# EAGLE design I2C-LEDStripDriver (EAGLE 7.7.0)
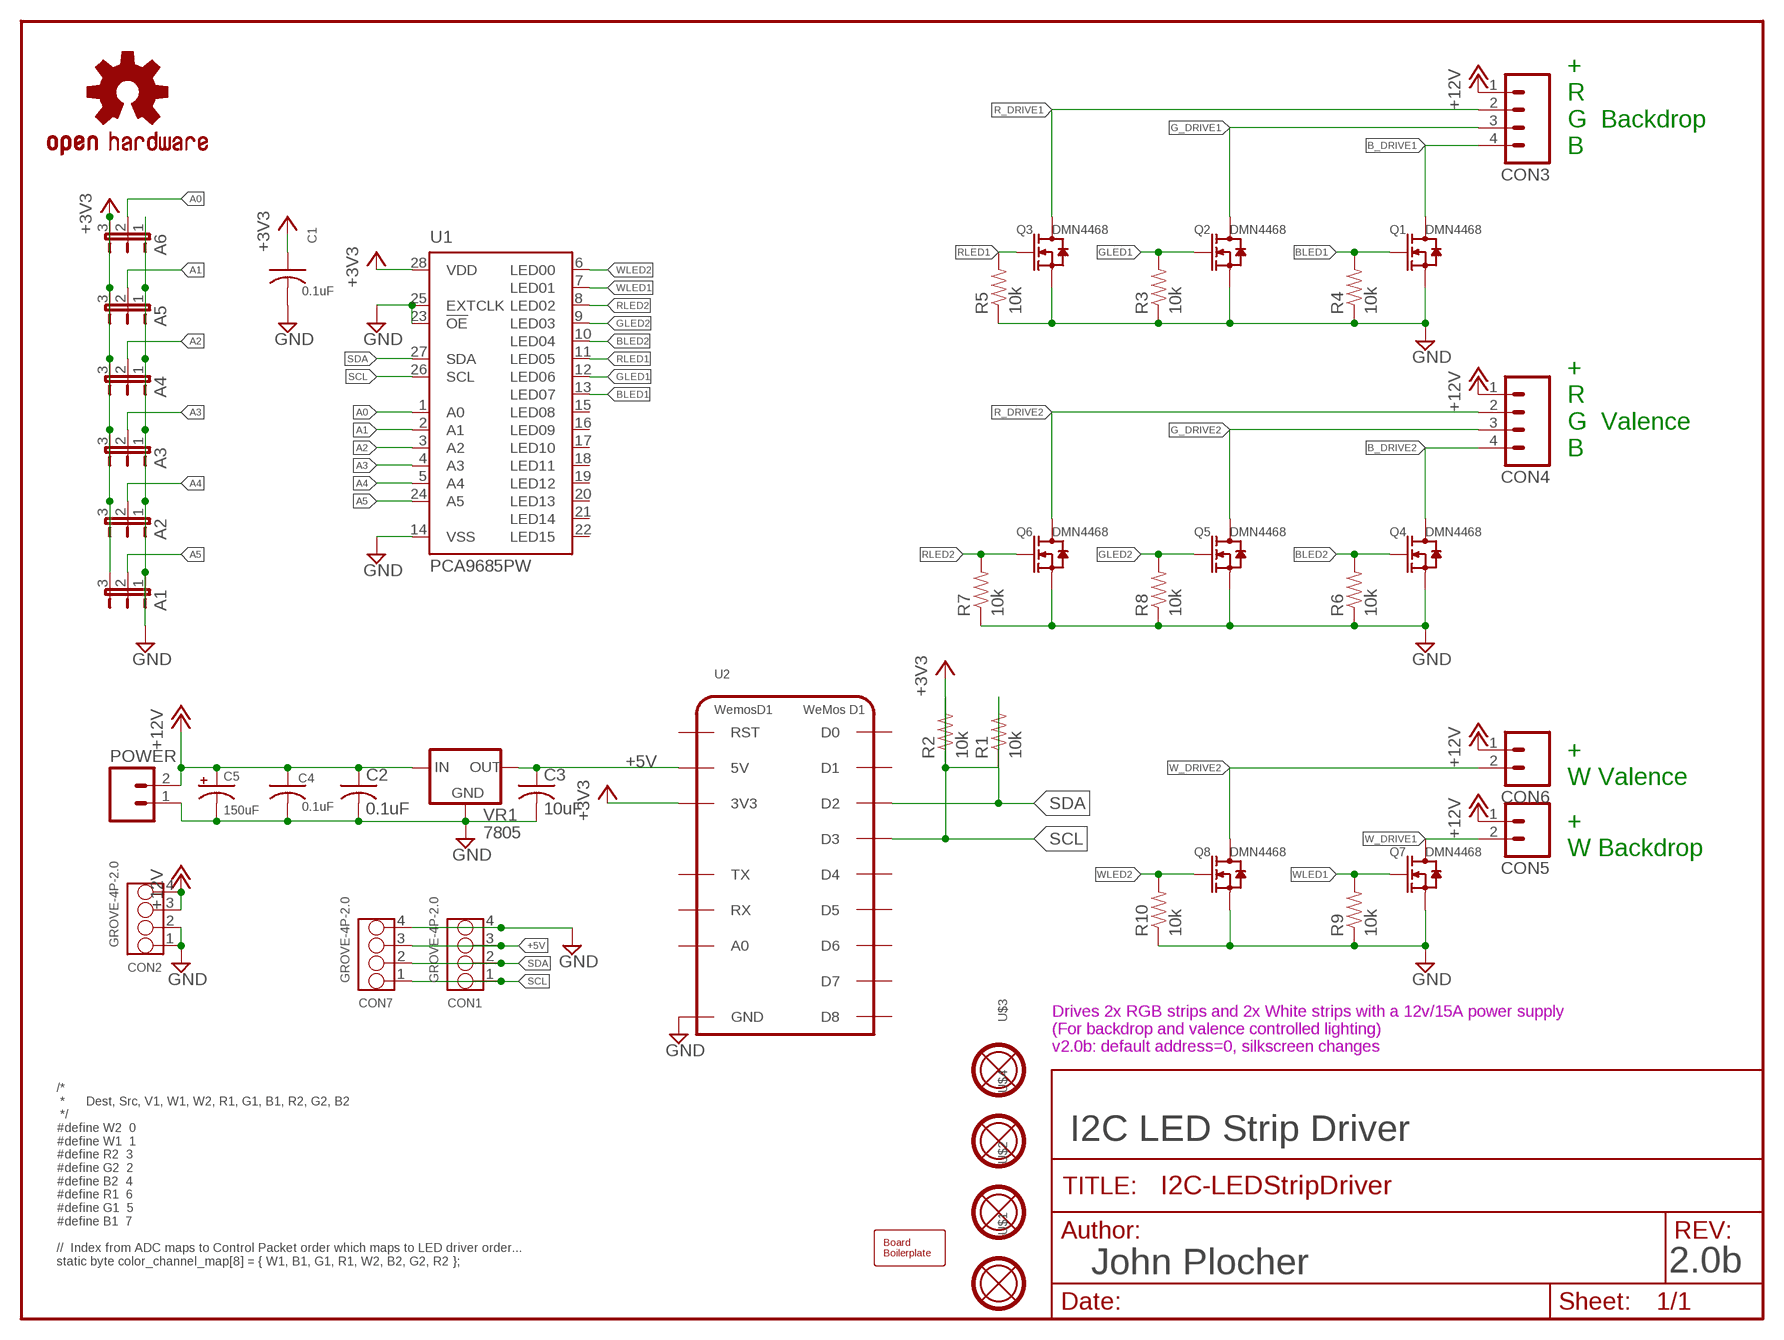
[diagram p0: schematic, sheet 1]

## Parts
A1  JUMPER-3PTH-LOCK  [1X03]
A2  JUMPER-3PTH-LOCK  [1X03]
A3  JUMPER-3PTH-LOCK  [1X03]
A4  JUMPER-3PTH-LOCK  [1X03]
A5  JUMPER-3PTH-LOCK  [1X03]
A6  JUMPER-3PTH-LOCK  [1X03]
BOARD1  BOARD80X100-TEMPLATE  [BOARD-10X8-TEMPLATE]
C1  0.1uF  CAP0603  [0603-CAP]
C2  0.1uF  CAP0805  [0805-CAP]
C3  10uF  CAP0805  [0805-CAP]
C4  0.1uF  CAP0603  [0603-CAP]
C5  150uF  CAP-POL0810  [0810-CAP]
CON1  GROVE-4P-2.0  CONNECTOR-GROVE-4P-2.0-3470130P1  [4P-2.0]
CON2  GROVE-4P-2.0  CONNECTOR-GROVE-4P-2.0-3470130P1  [4P-2.0]
CON3  CONNECTOR-M045.08  [MSTBA4]
CON4  CONNECTOR-M045.08  [MSTBA4]
CON5  CONNECTOR-M02MSTBA2  [MSTBA2]
CON6  CONNECTOR-M02MSTBA2  [MSTBA2]
CON7  GROVE-4P-2.0  CONNECTOR-GROVE-4P-2.0-3470130P1  [4P-2.0]
OSHW1  OSHW-LOGOL  [OSHW-LOGO-L]
POWER  CONNECTOR-M02MSTBA2  [MSTBA2]
Q1  DMN4468  MOSFET-N--SO8  [SO08]
Q2  DMN4468  MOSFET-N--SO8  [SO08]
Q3  DMN4468  MOSFET-N--SO8  [SO08]
Q4  DMN4468  MOSFET-N--SO8  [SO08]
Q5  DMN4468  MOSFET-N--SO8  [SO08]
Q6  DMN4468  MOSFET-N--SO8  [SO08]
Q7  DMN4468  MOSFET-N--SO8  [SO08]
Q8  DMN4468  MOSFET-N--SO8  [SO08]
R1  10k  R0603-RES  [0603-RES]
R2  10k  R0603-RES  [0603-RES]
R3  10k  R0603-RES  [0603-RES]
R4  10k  R0603-RES  [0603-RES]
R5  10k  R0603-RES  [0603-RES]
R6  10k  R0603-RES  [0603-RES]
R7  10k  R0603-RES  [0603-RES]
R8  10k  R0603-RES  [0603-RES]
R9  10k  R0603-RES  [0603-RES]
R10  10k  R0603-RES  [0603-RES]
U1  PCA9685PW  [TSSOP28]
U2  WemosD1  WEMOS-D1V1  [WEMOS-D1]
U$1  MOUNTINGHOLE  [MOUNTINGHOLE]
U$2  MOUNTINGHOLE  [MOUNTINGHOLE]
U$3  MOUNTINGHOLE  [MOUNTINGHOLE]
U$4  MOUNTINGHOLE  [MOUNTINGHOLE]
VR1  7805  VREG-DPAK-5  [TO-252]

## Nets
+3V3: A1.3 A2.3 A3.3 A4.3 A5.3 A6.3 C1.1 R1.1 R2.1 U1.28(VDD) U2.3V3
+5V: C3.1 CON1.3 CON7.3 U2.5V VR1.3(OUT)
+12V [Feed]: C2.1 C4.1 C5.+ CON2.3 CON2.4 CON3.1 CON4.1 CON5.1(A) CON6.1(A) POWER.2(B) VR1.1(IN)
A0: A6.2 U1.1(A0)
A1: A5.2 U1.2(A1)
A2: A4.2 U1.3(A2)
A3: A3.2 U1.4(A3)
A4: A2.2 U1.5(A4)
A5: A1.2 U1.24(A5)
B_DRIVE1: CON3.4 Q1.5(D) Q1.6(D) Q1.7(D) Q1.8(D)
B_DRIVE2: CON4.4 Q4.5(D) Q4.6(D) Q4.7(D) Q4.8(D)
BLED1: Q1.4(G) R4.2 U1.13(LED07)
BLED2: Q4.4(G) R6.2 U1.10(LED04)
G_DRIVE1: CON3.3 Q2.5(D) Q2.6(D) Q2.7(D) Q2.8(D)
G_DRIVE2: CON4.3 Q5.5(D) Q5.6(D) Q5.7(D) Q5.8(D)
GLED1: Q2.4(G) R3.2 U1.12(LED06)
GLED2: Q5.4(G) R8.2 U1.9(LED03)
GND: A1.1 A2.1 A3.1 A4.1 A5.1 A6.1 C1.2 C2.2 C3.2 C4.2 C5.- CON1.4 CON2.1 CON2.2 CON7.4 POWER.1(A) Q1.1(S) Q1.2(S) Q1.3(S) Q2.1(S) Q2.2(S) Q2.3(S) Q3.1(S) Q3.2(S) Q3.3(S) Q4.1(S) Q4.2(S) Q4.3(S) Q5.1(S) Q5.2(S) Q5.3(S) Q6.1(S) Q6.2(S) Q6.3(S) Q7.1(S) Q7.2(S) Q7.3(S) Q8.1(S) Q8.2(S) Q8.3(S) R3.1 R4.1 R5.1 R6.1 R7.1 R8.1 R9.1 R10.1 U1.14(VSS) U1.23(!OE) U1.25(EXTCLK) U2.GND VR1.2(GND)
R_DRIVE1: CON3.2 Q3.5(D) Q3.6(D) Q3.7(D) Q3.8(D)
R_DRIVE2: CON4.2 Q6.5(D) Q6.6(D) Q6.7(D) Q6.8(D)
RLED1: Q3.4(G) R5.2 U1.11(LED05)
RLED2: Q6.4(G) R7.2 U1.8(LED02)
SCL: CON1.1 CON7.1 R2.2 U1.26(SCL) U2.D3
SDA: CON1.2 CON7.2 R1.2 U1.27(SDA) U2.D2
W_DRIVE1: CON5.2(B) Q7.5(D) Q7.6(D) Q7.7(D) Q7.8(D)
W_DRIVE2: CON6.2(B) Q8.5(D) Q8.6(D) Q8.7(D) Q8.8(D)
WLED1: Q7.4(G) R9.2 U1.7(LED01)
WLED2: Q8.4(G) R10.2 U1.6(LED00)
Unconnected: U1.15(LED08) U1.16(LED09) U1.17(LED10) U1.18(LED11) U1.19(LED12) U1.20(LED13) U1.21(LED14) U1.22(LED15) U2.A0 U2.D0 U2.D1 U2.D4 U2.D5 U2.D6 U2.D7 U2.D8 U2.RST U2.RX U2.TX

## Notes on the sheet
- +
  R
  G  Backdrop
  B
- +
  R
  G  Valence
  B
- +
  W Valence
- +
  W Backdrop
- Drives 2x RGB strips and 2x White strips with a 12v/15A power supply
  (For backdrop and valence controlled lighting)
  v2.0b: default address=0, silkscreen changes
- I2C LED Strip Driver
- /*     
   *      Dest, Src, V1, W1, W2, R1, G1, B1, R2, G2, B2
   */
  #define W2  0
  #define W1  1
  #define R2  3
  #define G2  2
  #define B2  4
  #define R1  6
  #define G1  5
  #define B1  7
    
  //  Index from ADC maps to Control Packet order which maps to LED driver order...
  static byte color_channel_map[8] = { W1, B1, G1, R1, W2, B2, G2, R2 };
- John Plocher | 2.0b

## Library data of the parts
A1-A6 = SPCoast:JUMPER-3
BOARD1 = SPCoast:BOARD
C1-C4 = SPCoast:CAP*
C5 = SPCoast:CAP-POL*
CON1 CON2 CON7 = SPCoast:CONNECTOR-GROVE-4P-2.0
CON3 CON4 = SPCoast:CONNECTOR-M04: Header 4 Standard 4-pin 0.1" header. Use with straight break away headers (SKU : PRT-00116), right angle break away headers (PRT-00553), swiss pins (PRT-00743), machine pins (PRT-00117), and female headers (PRT-00115). Molex polarized connector foot print use with SKU : PRT-08231 with associated crimp pins and housings. 1MM SMD Version SKU: PRT-10208
CON5 CON6 POWER = SPCoast:CONNECTOR-M02: PHOENIX CONNECTOR
OSHW1 = SparkFun:OSHW-LOGO: Open Source Hardware Logo This logo indicates the piece of hardware it is found on incorporates a OSHW license and/or adheres to the definition of open source hardware found here: http://freedomdefined.org/OSHW
Q1-Q8 = SPCoast:MOSFET-N-*-?: CJ2302：SMD MOSFET N-CH 20V-2.1A DMN4468 - SO8 30v/10A
R1-R10 = SPCoast:R*: Resistor Basic schematic elements and footprints for 0603, 1206, and PTH 1/10th watt (small) resistors.
U1 = SPCoast:PCA9685
U2 = SPCoast:WEMOS-D1
U$1-U$4 = SPCoast:MOUNTINGHOLE: Mounting hole with top and bottom copper and stop rings
VR1 = SPCoast:VREG-?-*: Voltage Regulator Standard linear regulator. 7805 uses IGO pinout LM1117 uses GOI pinout

## Net classes
0 default: width 0.254 mm, drill 0.5 mm, clearance 0.203 mm
1 Power: width 0.406 mm, drill 0.6 mm, clearance 0.203 mm
2 signals: width 0.305 mm, drill 0.6 mm, clearance 0.203 mm
3 Feed: width 1.016 mm, drill 1.4 mm, clearance 0.203 mm

## Board
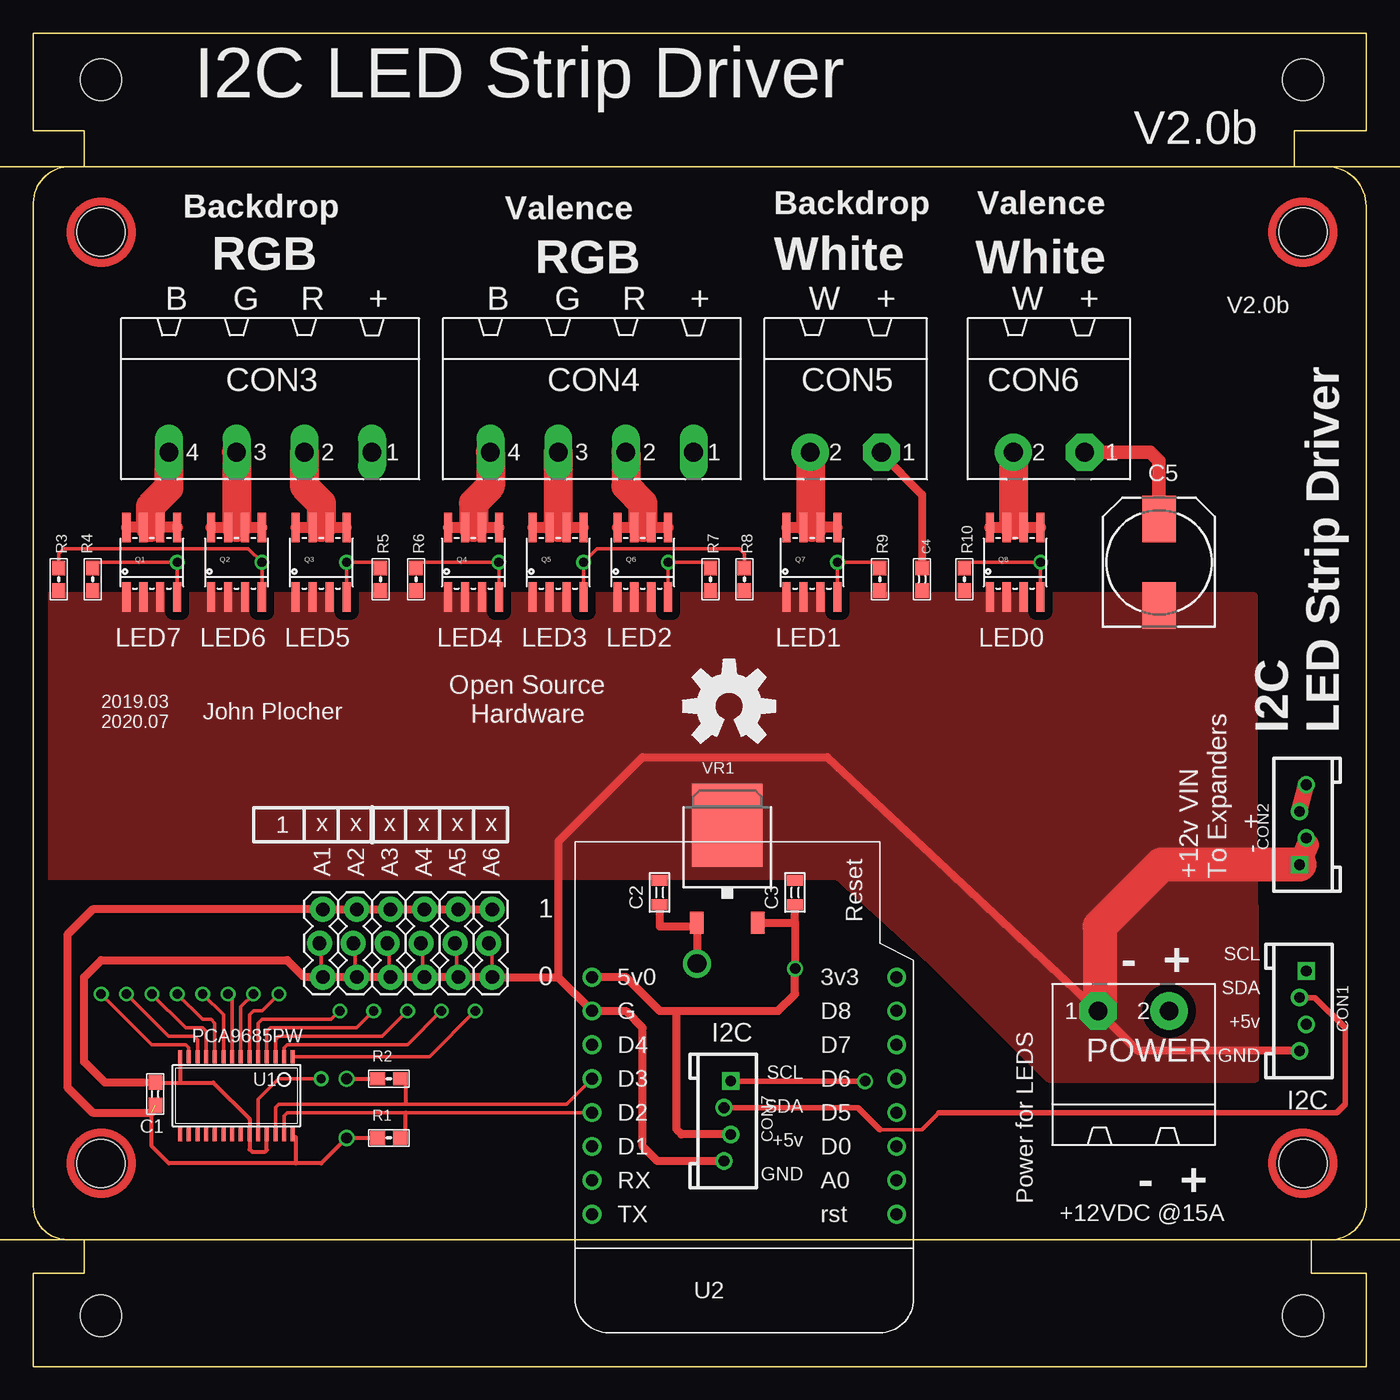
[diagram p1: board, top side]
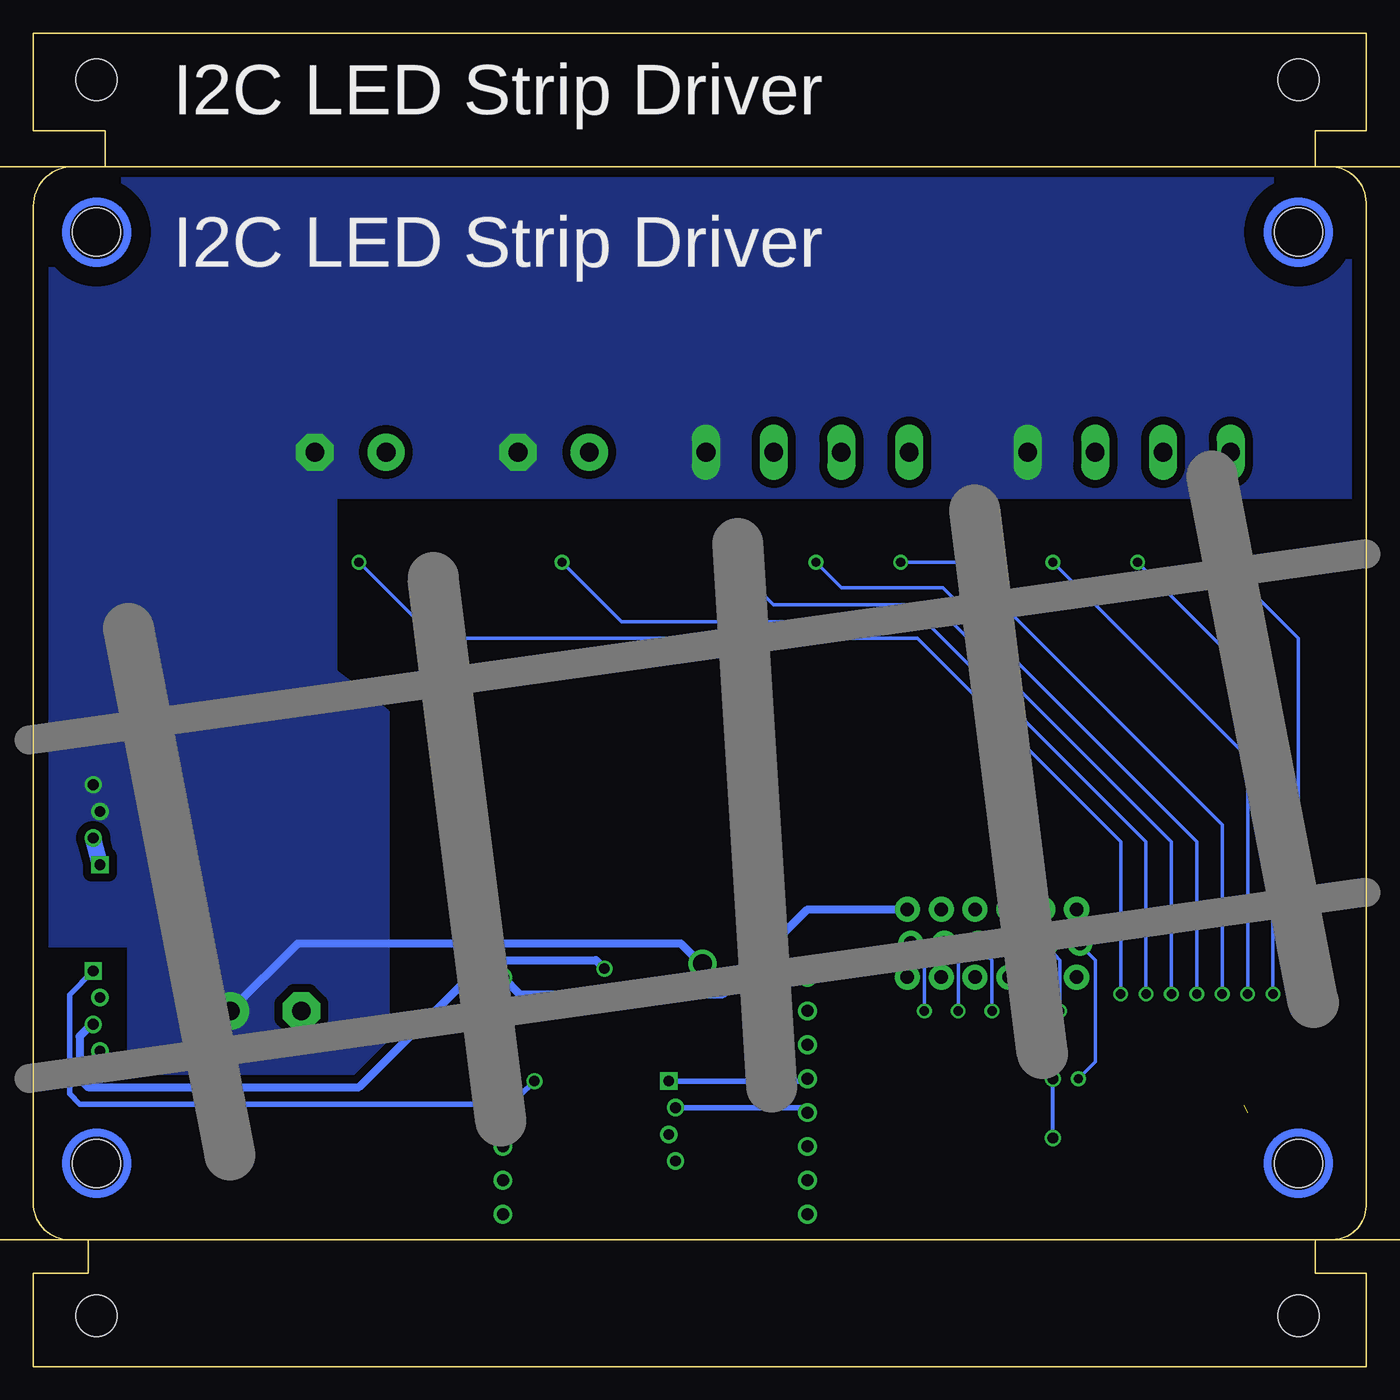
[diagram p2: board, bottom side, seen from below]

Size 100.01 x 100 mm. Coordinates in mm from the lower left corner, seen from the top.
Copper layers (1*16): Top 0.035mm / dielectric 1.5mm / Bottom 0.035mm
Design rules "default": minimum track width 10mil, minimum drill 0.6mm, track to track 8mil, track to pad 8mil, pad to pad 8mil, via to via 8mil, smd to smd 8mil, copper to edge 40mil, drill to drill 8mil, minimum pad ring 10mil, minimum via ring 8mil, stop-mask expansion 4mil, vias tented up to drill 0mil, thermal gap 10mil

### Footprints (pad centres in the part's own frame; a part is rotated, then mirrored left to right if it is on the bottom)
1X03 = drill 1.016 pad 1.88: 1 0,-0.127; 2 2.54,0.127; 3 5.08,-0.127
BOARD-10X8-TEMPLATE = hole 3.1: 5.08,96.52; 95.25,96.52; 5.08,3.81; 95.25,3.81
0603-CAP = smd 1.1 x 1: 1 -0.85,0; 2 0.85,0
0805-CAP = smd 0.8 x 1.2: 1 -0.9,0; 2 0.9,0
0810-CAP = smd 3.5 x 2.5: + 3.25,0; - -3.25,0
4P-2.0 = drill 0.8 pad 1.27 square: 1 -3,0.254 | drill 0.8 pad 1.27: 2 -1,-0.254; 3 1,0.254; 4 3,-0.254
MSTBA4 = drill 1.397 long: 1 -7.62,5.08; 2 -2.54,5.08; 3 2.54,5.08; 4 7.62,5.08
MSTBA2 = drill 1.397 pad 2.794 octagon: 1 -2.667,5.08 | drill 1.397 pad 2.794: 2 2.667,5.08
SO08 = smd 0.61 x 2.21: 1 -1.905,-2.616; 2 -0.635,-2.616; 3 0.635,-2.616; 4 1.905,-2.616; 5 1.905,2.616; 6 0.635,2.616; 7 -0.635,2.616; 8 -1.905,2.616
0603-RES = smd 1.1 x 1: 1 -0.85,0; 2 0.85,0
TSSOP28 = smd 0.305 x 0.991: 1 -4.225,-2.918; 2 -3.575,-2.918; 3 -2.925,-2.918; 4 -2.275,-2.918; 5 -1.625,-2.918; 6 -0.975,-2.918; 7 -0.325,-2.918; 8 0.325,-2.918; 9 0.975,-2.918; 10 1.625,-2.918; 11 2.275,-2.918; 12 2.925,-2.918; 13 3.575,-2.918; 14 4.225,-2.918; 15 4.225,2.918; 16 3.575,2.918; 17 2.925,2.918; 18 2.275,2.918; 19 1.625,2.918; 20 0.975,2.918; 21 0.325,2.918; 22 -0.325,2.918; 23 -0.975,2.918; 24 -1.625,2.918; 25 -2.275,2.918; 26 -2.925,2.918; 27 -3.575,2.918; 28 -4.225,2.918
WEMOS-D1 = drill 0.9: 3V3 -11.43,-7.62; 5V 11.43,-7.62; A0 -11.43,7.62; D0 -11.43,5.08; D1 11.43,5.08; D2 11.43,2.54; D3 11.43,0; D4 11.43,-2.54; D5 -11.43,2.54; D6 -11.43,0; D7 -11.43,-2.54; D8 -11.43,-5.08; GND 11.43,-5.08; RST -11.43,10.16; RX 11.43,7.62; TX 11.43,10.16
MOUNTINGHOLE = hole 3.6: 0,0
TO-252 = smd 1.016 x 1.651: 1 -2.286,-4.826; 3 2.286,-4.826 | smd 5.3 x 6.2: 2 0,2.5

### Placement (x,y rotation side)
A1  21.6,29.21 90 top
A2  24.14,29.21 90 top
A3  26.68,29.21 90 top
A4  29.22,29.21 90 top
A5  31.76,29.21 90 top
A6  34.3,29.21 90 top
BOARD1  0.01,0 0 top
C1  9.15,20.45 90 top
C2  47,35.56 90 top
C3  57.16,35.56 90 top
C4  66.68,59.05 270 top
C5  84.46,60.33 90 top
CON1  95.26,26.67 270 top
CON2  95.26,40.64 90 top
CON3  17.79,73.66 180 top
CON4  41.92,73.66 180 top
CON5  60.97,73.66 180 top
CON6  76.21,73.66 180 top
CON7  52.08,18.41 270 top
OSHW1  52.2,49.53 0 top
POWER  82.56,21.59 0 top
Q1  8.9,60.33 0 top
Q2  15.25,60.33 0 top
Q3  21.6,60.33 0 top
Q4  33.03,60.33 0 top
Q5  39.38,60.33 0 top
Q6  45.73,60.33 0 top
Q7  58.43,60.33 0 top
Q8  73.67,60.33 0 top
R1  26.68,17.14 0 top
R2  26.68,21.59 0 top
R3  1.91,59.05 90 top
R4  4.45,59.05 90 top
R5  26.04,59.05 90 top
R6  28.71,59.05 90 top
R7  50.81,59.05 90 top
R8  53.35,59.05 90 top
R9  63.51,59.05 90 top
R10  69.86,59.05 90 top
U1  15.25,20.32 180 top
U2  53.35,21.59 180 top
U$1  5.09,15.24 0 top
U$2  95.26,15.24 0 top
U$3  5.09,85.09 0 top
U$4  95.26,85.09 0 top
VR1  52.08,38.1 0 top

### Tracks (layer width: path | path; a pad name or v marks a point on that pad's centre or on a via)
+3V3  (via drill 0.8)  (1 unrouted)
  Top 0.305: 19.69,15.24 21.6,15.24 v23.5,17.14 R1.1 | 19.69,15.24 10.17,15.24 8.9,16.51 8.9,19.05 | v23.5,21.59 R2.1 | U1.28 19.69,17.18 19.69,15.24
  Top 0.61: 34.42,34.16 A6.3 A5.3 A4.3 A3.3 A2.3 A1.3 4.45,34.29 2.55,32.38 2.55,20.95 4.45,19.05 8.9,19.05
  Bottom 0.305: v23.5,17.14 v23.5,21.59
  Bottom 0.61: U2.3V3 63.51,27.94 48.27,27.94 41.92,34.29 A6.3
+5V  (via drill 0.8)
  Top 0.61: VR1.3 57.16,33.27 | 57.16,33.27 C3.1 | 57.16,33.27 v57.16,29.84 57.16,27.94 55.89,26.67 48.27,26.67 | U2.5V 44.46,29.21 47,26.67 48.27,26.67 | CON7.3 48.63,17.41 48.27,17.78 48.27,26.67
  Bottom 0.406: CON1.3 95.62,25.67
  Bottom 0.61: 95.62,25.67 96.53,24.77 96.53,21.59 95.89,20.95 75.57,20.95 66.05,30.48 57.79,30.48 v57.16,29.84
+12V  (via drill 1.4)
  Top 0.61: C2.1 47,33.02 49.54,33.02 VR1.1 v49.79,30.23 | CON5.1 63.63,68.45 66.68,65.41 C4.1
  Top 1.016: C5.+ 84.46,67.94 83.83,68.58 CON6.1
  Top 1.27: CON2.3 CON2.4
  Bottom 0.61: POWER.2 80.14,31.75 51.44,31.75 49.92,30.23 v49.79,30.23
  pour Bottom (isolate 0.61, rank 2, no thermals): 73.54,20.32 73.54,49.02 77.48,52.07 77.48,65.41 0.01,65.41 0.01,88.9 99.07,88.9 99.07,31.75 92.72,31.75 92.72,20.32
A0  (via drill 0.7)
  Top 0.254: v33.15,26.67 29.72,23.24 U1.1
  Bottom 0.254: A6.2 34.3,31.75 33.15,30.48 v33.15,26.67
A1  (via drill 0.7)
  Top 0.254: v30.61,26.67 28.07,24.13 19.06,24.13 18.82,23.89 U1.2
  Bottom 0.254: A5.2 31.76,31.75 30.61,30.48 v30.61,26.67
A2  (via drill 0.7)
  Top 0.254: v28.07,26.67 26.17,24.77 18.42,24.77 18.17,24.52 U1.3
  Bottom 0.254: A4.2 29.22,31.75 28.07,30.48 v28.07,26.67
A3  (via drill 0.7)
  Top 0.254: v25.53,26.67 24.26,25.4 17.79,25.4 17.52,25.14 U1.4
  Bottom 0.254: A3.2 26.68,31.75 25.53,30.48 v25.53,26.67
A4  (via drill 0.7)
  Top 0.254: v22.99,26.67 22.36,26.04 17.15,26.04 16.87,25.75 U1.5
  Bottom 0.254: A2.2 24.14,31.75 22.99,30.48 v22.99,26.67
A5  (via drill 0.7)
  Top 0.254: U1.24 16.87,20.04 18.42,21.59 v21.6,21.59
  Bottom 0.254: A1.2 21.6,31.75 20.33,30.48 20.33,22.86 v21.6,21.59
B_DRIVE1
  Top 0.813: Q1.5 Q1.6 8.77,62.94 Q1.7 Q1.8
  Top 2.184: CON3.4 10.17,65.91 8.77,64.52 8.77,62.94
B_DRIVE2
  Top 0.813: Q4.8 Q4.7 33.03,62.94 Q4.6 Q4.5
  Top 2.184: CON4.4 34.3,66.04 33.03,64.77 33.03,62.94
BLED1  (via drill 0.7)
  Top 0.254: U1.13 11.67,23.89 11.44,24.13 8.9,24.13 v5.09,27.94 | Q1.4 v10.8,60.33 4.87,60.33 R4.2
  Bottom 0.254: v5.09,27.94 5.09,54.61 v10.8,60.33
BLED2  (via drill 0.7)
  Top 0.254: U1.10 13.62,25.75 13.34,26.04 12.71,26.04 v10.8,27.94 | Q4.4 v34.93,60.33 28.71,60.33 R6.2
  Bottom 0.254: v10.8,27.94 10.8,40.64 30.49,60.33 v34.93,60.33
G_DRIVE1
  Top 0.61: Q2.7 15.25,62.94 Q2.6
  Top 0.813: Q2.8 Q2.7 | Q2.6 Q2.5
  Top 2.184: CON3.3 15.25,62.94
G_DRIVE2
  Top 0.61: Q5.7 39.38,62.94 Q5.6
  Top 0.813: Q5.8 Q5.7 | Q5.6 Q5.5
  Top 2.184: CON4.3 39.38,62.94
GLED1  (via drill 0.7)
  Top 0.254: U1.12 12.32,24.52 12.07,24.77 10.17,24.77 v6.99,27.94 | Q2.4 v17.15,60.33 16.14,61.34 2.29,61.34 1.91,60.96 R3.2
  Bottom 0.254: v6.99,27.94 6.99,50.16 v17.15,60.33
GLED2  (via drill 0.7)
  Top 0.254: U1.9 14.27,26.38 v12.71,27.94 | Q5.4 v41.28,60.33 42.3,61.34 52.97,61.34 53.35,60.96 R8.2
  Bottom 0.254: v12.71,27.94 12.71,39.37 31.76,58.42 39.38,58.42 v41.28,60.33
GND
  Top 0.254: A6.1 34.42,31.62 34.3,31.75 | 31.76,29.21 31.76,31.75 | A4.1 29.22,29.34 29.22,31.75 | 26.68,29.21 26.68,31.75 | 24.14,29.21 24.14,31.75 | A1.1 21.6,29.34 21.6,31.75
  Top 0.305: 17.53,17.41 U1.25 17.52,16.25 17.41,16.13 16.39,16.13 16.22,16.3 U1.23 16.22,18.58 13.51,21.3 11.02,21.3 | C1.2 11.02,21.3 | U1.14 11.02,21.3
  Top 0.61: 39.38,29.21 U2.GND 44.46,26.67 45.73,25.4 45.73,16.51 46.82,15.41 CON7.4 | C1.2 5.38,21.3 3.82,22.86 3.82,29.21 5.09,30.48 19.06,30.48 20.33,29.21 A1.1 24.14,29.21 A2.1 26.68,29.21 A3.1 A4.1 31.76,29.21 A5.1 A6.1 39.38,29.21 | CON1.4 82.89,23.67 POWER.1 59.57,45.72 45.73,45.72 39.38,39.37 39.38,29.21
  Top 1.27: CON2.2 95.64,39.13
  Top 1.676: 95.64,39.13 CON2.1
  Top 2.54: CON2.1 84.64,37.64 80.02,33.02 80.02,26.8 POWER.1
  Bottom 1.27: CON2.1 95.51,39.62
  pour Top (isolate 0.61, no thermals): 91.57,57.78 0.01,57.78 0.01,36.83 60.33,36.83 67.32,30.48 76.21,21.59 91.7,21.59 91.7,29.97 91.57,39.37
R_DRIVE1
  Top 0.813: Q3.8 Q3.7 21.6,62.94 Q3.6 Q3.5
  Top 2.184: CON3.2 20.33,66.04 21.6,64.77 21.6,62.94
R_DRIVE2
  Top 0.813: Q6.8 Q6.7 45.73,62.94 Q6.6 Q6.5
  Top 2.184: CON4.2 44.46,66.04 45.73,64.77 45.73,62.94
RLED1  (via drill 0.7)
  Top 0.254: U1.11 12.97,25.14 12.71,25.4 11.44,25.4 v8.9,27.94 | Q3.4 v23.5,60.33 25.62,60.33 arc-90 R5.2
  Bottom 0.254: v8.9,27.94 8.9,45.72 v23.5,60.33
RLED2  (via drill 0.7)
  Top 0.254: U1.8 14.92,27.63 v14.61,27.94 | Q6.4 v47.63,60.33 50.81,60.33 R7.2
  Bottom 0.254: v14.61,27.94 14.61,39.37 32.39,57.15 44.46,57.15 v47.63,60.33
SCL  (via drill 0.8)
  Top 0.254: U1.26 18.17,19.43 18.42,19.68 27.95,19.68 40.01,19.68 U2.D3
  Top 0.305: R2.2 27.95,21.17 27.95,19.68
  Top 0.406: v62.41,21.41 CON7.1
  Bottom 0.254: 63.51,20.32 66.05,20.32 | U2.D3 42.09,21.41
  Bottom 0.406: 66.05,20.32 66.68,19.68 96.53,19.68 97.29,20.45 97.29,27.89 CON1.1 | 42.09,21.41 CON7.1 | 63.51,20.32 v62.41,21.41
SDA
  Top 0.254: U1.27 18.82,18.82 19.06,19.05 27.95,19.05 U2.D2 | 63.51,17.78 66.68,17.78 | R1.2 27.95,17.57
  Top 0.305: 27.95,17.57 27.95,19.05 | 66.68,17.78 67.95,19.05
  Top 0.406: 63.51,17.78 61.87,19.41 CON7.2 | 67.95,19.05 97.8,19.05 98.43,19.68 98.43,25.4 96.16,27.67 CON1.2
  Bottom 0.254: U2.D2 42.28,19.41
  Bottom 0.406: 42.28,19.41 CON7.2
W_DRIVE1
  Top 0.61: Q7.7 58.43,62.94 Q7.6
  Top 0.813: Q7.8 Q7.7 | Q7.5 Q7.6
  Top 2.184: CON5.2 58.3,63.07 58.43,62.94
W_DRIVE2
  Top 0.61: Q8.7 73.67,62.94 | 73.67,62.94 Q8.6 | 73.54,63.07 73.67,62.94
  Top 0.813: Q8.8 Q8.7 | Q8.6 Q8.5
  Top 2.184: CON6.2 73.54,63.07
WLED1  (via drill 0.7)
  Top 0.254: U1.7 15.57,27 v16.52,27.94 | Q7.4 v60.33,60.33 63.51,60.33 R9.2
  Bottom 0.254: v16.52,27.94 16.52,39.37 33.03,55.88 55.89,55.88 v60.33,60.33
WLED2  (via drill 0.7)
  Top 0.254: U1.6 16.22,26.38 16.52,26.67 17.15,26.67 v18.42,27.94 | Q8.4 v75.57,60.33 69.86,60.33 R10.2
  Bottom 0.254: v18.42,27.94 18.42,39.37 33.66,54.61 69.86,54.61 v75.57,60.33

### Text on the board
tPlace: I2C LED Strip Driver | V2.0b | Backdrop | Valence | Backdrop | Valence | RGB | RGB | White | White | B | G | R | + | B | G | R | + | W | + | W | + | V2.0b | LED7 | LED6 | LED5 | LED4 | LED3 | LED2 | LED1 | LED0 | Open Source | 2019.03 / 2020.07 | John Plocher | Hardware | I2C / LED Strip Driver | 1 | x | x | x | x | x | x | - + | +12v VIN / To Expanders | 1 | - + | SCL | 0 | SDA | I2C | +5v | GND | SCL | I2C | SDA | +5v | GND | - + | Power for LEDS | +12VDC @15A
bPlace: I2C LED Strip Driver | I2C LED Strip Driver
bDocu: Made in the PCR, Coast Division, NMRA | 2x RGB + 2x White / (Backdrop and valence) | Go Bears! | Model Railroading / is fun! | www. SP Coast .com